# Altium schematic sheet Output_Connectors.SchDoc
size A4; SheetNumber: 6; SheetTotal: 7
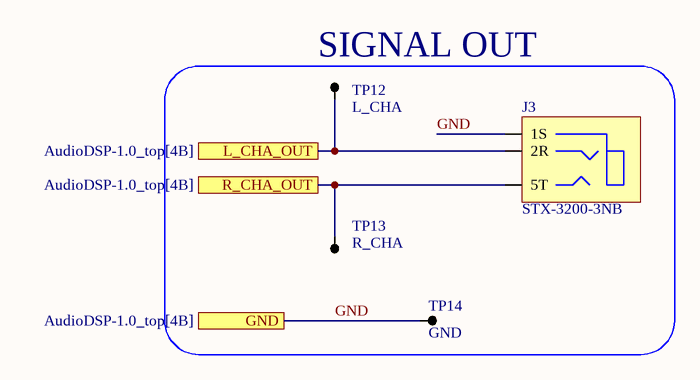
[diagram p0: Output_Connectors.SchDoc]

## Parts
J3  STX-3200-3NB  [JACK-3.5-3POS]
TP12  L_CHA  [534-5280]
TP13  R_CHA  [534-5280]
TP14  GND  [534-5280]

## Blocks framed on the sheet
SIGNAL OUT: J3 TP12-TP14

## Ports
GND (see AudioDSP-1.0_top[4B]), L_CHA_OUT (see AudioDSP-1.0_top[4B]), R_CHA_OUT (see AudioDSP-1.0_top[4B])

## Nets
GND: J3.1S TP14.1 ; port GND
L_CHA_OUT: J3.2R TP12.1 ; port L_CHA_OUT
R_CHA_OUT: J3.5T TP13.1 ; port R_CHA_OUT

## Library data of the parts
TP12-TP14 = TP-CLAW